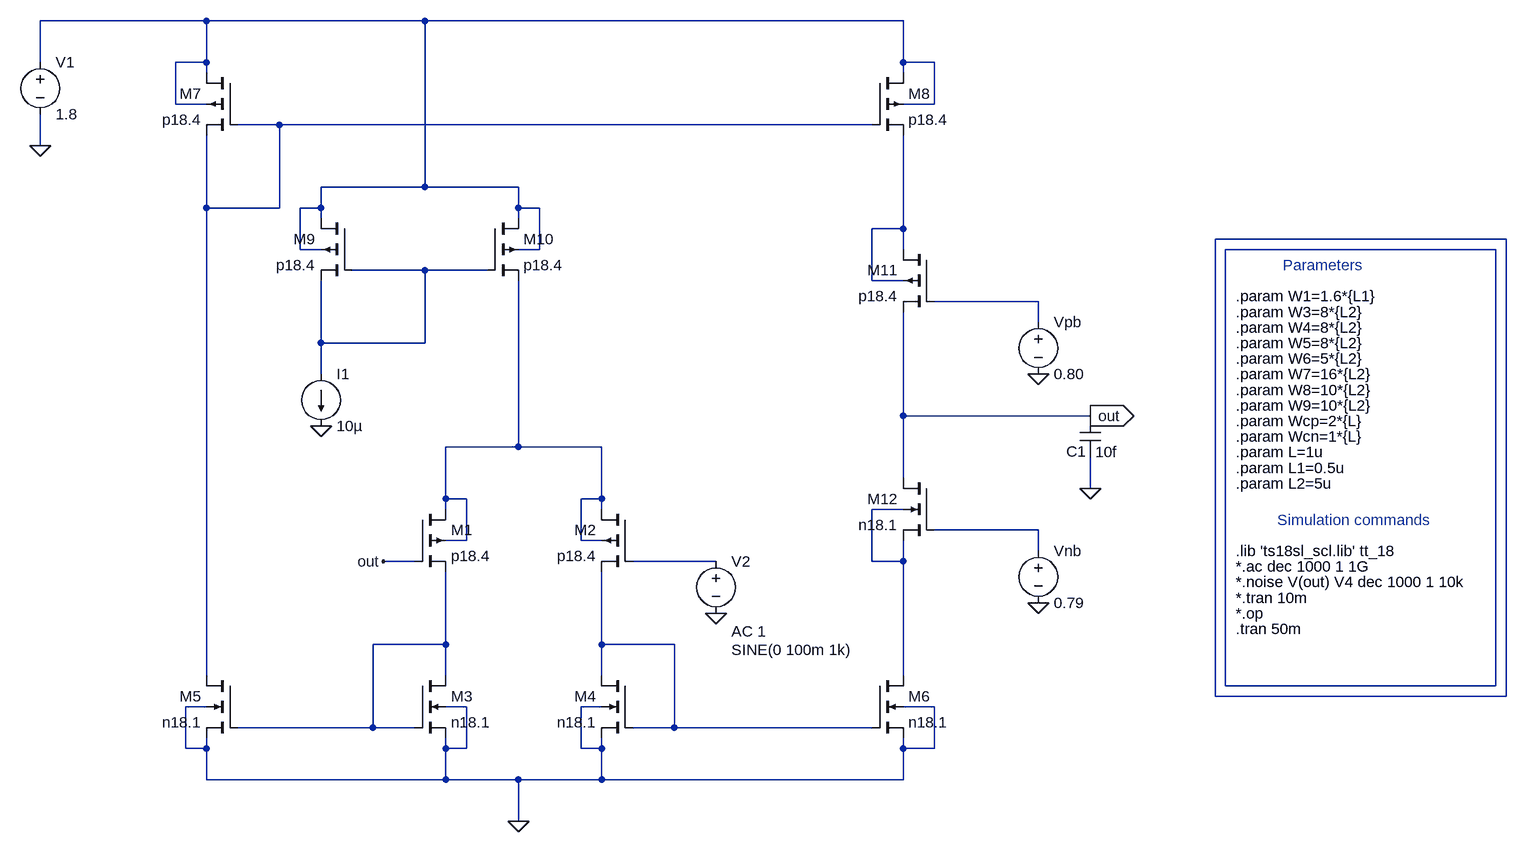
[diagram p0: schematic OTA.asc]
OTA.asc, the LTspice schematic file:
Version 4
SHEET 1 1780 1048
WIRE -224 -624 -480 -624
WIRE 112 -624 -224 -624
WIRE 848 -624 112 -624
WIRE -480 -560 -480 -624
WIRE -224 -560 -224 -624
WIRE -224 -560 -272 -560
WIRE 848 -560 848 -624
WIRE 896 -560 848 -560
WIRE -224 -544 -224 -560
WIRE 848 -544 848 -560
WIRE -272 -496 -272 -560
WIRE -224 -496 -272 -496
WIRE 896 -496 896 -560
WIRE 896 -496 848 -496
WIRE -112 -464 -176 -464
WIRE 800 -464 -112 -464
WIRE -480 -432 -480 -480
WIRE 112 -368 112 -624
WIRE 112 -368 -48 -368
WIRE 256 -368 112 -368
WIRE -224 -336 -224 -448
WIRE -112 -336 -112 -464
WIRE -112 -336 -224 -336
WIRE -48 -336 -48 -368
WIRE -48 -336 -80 -336
WIRE 256 -336 256 -368
WIRE 288 -336 256 -336
WIRE -48 -320 -48 -336
WIRE 256 -320 256 -336
WIRE 848 -304 848 -448
WIRE 848 -304 800 -304
WIRE 1776 -288 1328 -288
WIRE -80 -272 -80 -336
WIRE -48 -272 -80 -272
WIRE 288 -272 288 -336
WIRE 288 -272 256 -272
WIRE 848 -272 848 -304
WIRE 1760 -272 1344 -272
WIRE 112 -240 0 -240
WIRE 208 -240 112 -240
WIRE 800 -224 800 -304
WIRE 848 -224 800 -224
WIRE 1056 -192 896 -192
WIRE 1056 -160 1056 -192
WIRE -48 -128 -48 -224
WIRE 112 -128 112 -240
WIRE 112 -128 -48 -128
WIRE -48 -80 -48 -128
WIRE 848 -16 848 -176
WIRE 1136 -16 848 -16
WIRE 256 32 256 -224
WIRE 256 32 144 32
WIRE 384 32 256 32
WIRE 848 80 848 -16
WIRE 1136 96 1136 48
WIRE 144 112 144 32
WIRE 176 112 144 112
WIRE 384 112 384 32
WIRE 384 112 352 112
WIRE 144 128 144 112
WIRE 384 128 384 112
WIRE 848 128 800 128
WIRE 1056 160 896 160
WIRE 176 176 176 112
WIRE 176 176 144 176
WIRE 352 176 352 112
WIRE 384 176 352 176
WIRE 1056 192 1056 160
WIRE 96 208 48 208
WIRE 560 208 432 208
WIRE 800 208 800 128
WIRE 848 208 848 176
WIRE 848 208 800 208
WIRE 144 336 144 224
WIRE 144 336 32 336
WIRE 384 336 384 224
WIRE 496 336 384 336
WIRE -224 384 -224 -336
WIRE 144 384 144 336
WIRE 384 384 384 336
WIRE 848 384 848 208
WIRE 1344 400 1344 -272
WIRE 1760 400 1760 -272
WIRE 1760 400 1344 400
WIRE 1328 416 1328 -288
WIRE 1776 416 1776 -288
WIRE 1776 416 1328 416
WIRE -224 432 -256 432
WIRE 176 432 144 432
WIRE 384 432 352 432
WIRE 896 432 848 432
WIRE 32 464 32 336
WIRE 32 464 -176 464
WIRE 96 464 32 464
WIRE 496 464 496 336
WIRE 496 464 432 464
WIRE 800 464 496 464
WIRE -256 496 -256 432
WIRE -224 496 -224 480
WIRE -224 496 -256 496
WIRE 144 496 144 480
WIRE 176 496 176 432
WIRE 176 496 144 496
WIRE 352 496 352 432
WIRE 384 496 384 480
WIRE 384 496 352 496
WIRE 848 496 848 480
WIRE 896 496 896 432
WIRE 896 496 848 496
WIRE -224 544 -224 496
WIRE 144 544 144 496
WIRE 144 544 -224 544
WIRE 256 544 144 544
WIRE 384 544 384 496
WIRE 384 544 256 544
WIRE 848 544 848 496
WIRE 848 544 384 544
WIRE 256 608 256 544
FLAG -48 0 0
FLAG 256 608 0
FLAG -480 -432 0
FLAG 1136 96 0
FLAG 1056 -80 0
FLAG 1056 272 0
FLAG 1136 -16 out
IOPIN 1136 -16 Out
FLAG 48 208 out
FLAG 560 288 0
DATAFLAG 256 32 ""
DATAFLAG 256 32 ""
DATAFLAG 848 -304 ""
DATAFLAG 848 256 ""
DATAFLAG 848 256 ""
DATAFLAG -48 -128 ""
DATAFLAG -224 240 ""
DATAFLAG -112 464 ""
DATAFLAG 352 -464 ""
DATAFLAG 848 -16 ""
DATAFLAG 848 -16 ""
DATAFLAG 384 336 ""
DATAFLAG 384 336 ""
SYMBOL pmos4 96 128 R0
SYMATTR InstName M1
SYMATTR Value p18.4
SYMATTR Value2 l={L1} w={W1} ad={5*{W1}*{L1/2}} as={5*{W1}*{L1/2}} pd={5*{L1} + 2*{W1}} ps={5*{L1} + 2*{W1}}
SYMBOL nmos4 96 384 R0
SYMATTR InstName M3
SYMATTR Value n18.1
SYMATTR Value2 l={L2} w={W3} ad={5*{W3}*{L2/2}} as={5*{W3}*{L2/2}} pd={5*{L2} + 2*{W3}} ps={5*{L2} + 2*{W3}}
SYMBOL nmos4 800 384 R0
SYMATTR InstName M6
SYMATTR Value n18.1
SYMATTR Value2 l={L2} w={W6} ad={5*{W6}*{L2/2}} as={5*{W6}*{L2/2}} pd={5*{L2} + 2*{W6}} ps={5*{L2} + 2*{W6}}
SYMBOL pmos4 800 -544 R0
SYMATTR InstName M8
SYMATTR Value p18.4
SYMATTR Value2 l={L2} w={W8} ad={5*{W8}*{L2/2}} as={5*{W8}*{L2/2}} pd={5*{L2} + 2*{W8}} ps={5*{L2} + 2*{W8}}
SYMBOL pmos4 208 -320 R0
SYMATTR InstName M10
SYMATTR Value p18.4
SYMATTR Value2 l={L2} w={W9} ad={5*{W9}*{L2/2}} as={5*{W9}*{L2/2}} pd={5*{L2} + 2*{W9}} ps={5*{L2} + 2*{W9}}
SYMBOL current -48 -80 R0
WINDOW 123 0 0 Left 0
WINDOW 39 0 0 Left 0
SYMATTR InstName I1
SYMATTR Value 10µ
SYMBOL voltage -480 -576 R0
WINDOW 123 24 44 Left 2
WINDOW 39 0 0 Left 0
SYMATTR InstName V1
SYMATTR Value 1.8
SYMBOL cap 1120 -16 R0
WINDOW 0 -21 55 Left 2
SYMATTR InstName C1
SYMATTR Value 10f
SYMBOL voltage 1056 176 R0
WINDOW 123 0 0 Left 0
WINDOW 39 0 0 Left 0
SYMATTR InstName Vnb
SYMATTR Value 0.79
SYMBOL voltage 1056 -176 R0
WINDOW 123 0 0 Left 0
WINDOW 39 0 0 Left 0
SYMATTR InstName Vpb
SYMATTR Value 0.80
SYMBOL pmos4 0 -320 M0
SYMATTR InstName M9
SYMATTR Value p18.4
SYMATTR Value2 l={L2} w={W9} ad={5*{W9}*{L2/2}} as={5*{W9}*{L2/2}} pd={5*{L2} + 2*{W9}} ps={5*{L2} + 2*{W9}}
SYMBOL pmos4 -176 -544 M0
SYMATTR InstName M7
SYMATTR Value p18.4
SYMATTR Value2 l={L2} w={W7} ad={5*{W7}*{L2/2}} as={5*{W7}*{L2/2}} pd={5*{L2} + 2*{W7}} ps={5*{L2} + 2*{W7}}
SYMBOL nmos4 -176 384 M0
SYMATTR InstName M5
SYMATTR Value n18.1
SYMATTR Value2 l={L2} w={W5} ad={5*{W5}*{L2/2}} as={5*{W5}*{L2/2}} pd={5*{L2} + 2*{W5}} ps={5*{L2} + 2*{W5}}
SYMBOL nmos4 432 384 M0
SYMATTR InstName M4
SYMATTR Value n18.1
SYMATTR Value2 l={L2} w={W4} ad={5*{W4}*{L2/2}} as={5*{W4}*{L2/2}} pd={5*{L2} + 2*{W4}} ps={5*{L2} + 2*{W4}}
SYMBOL pmos4 432 128 M0
SYMATTR InstName M2
SYMATTR Value p18.4
SYMATTR Value2 l={L1} w={W1} ad={5*{W1}*{L1/2}} as={5*{W1}*{L1/2}} pd={5*{L1} + 2*{W1}} ps={5*{L1} + 2*{W1}}
SYMBOL pmos4 896 -272 M0
SYMATTR InstName M11
SYMATTR Value p18.4
SYMATTR Value2 l={L} w={Wcp} ad={5*{Wcp}*{L/2}} as={5*{Wcp}*{L/2}} pd={5*{L} + 2*{Wcp}} ps={5*{L} + 2*{Wcp}}
SYMBOL nmos4 896 80 M0
SYMATTR InstName M12
SYMATTR Value n18.1
SYMATTR Value2 l={L} w={Wcn} ad={5*{Wcn}*{L/2}} as={5*{Wcn}*{L/2}} pd={5*{L} + 2*{Wcn}} ps={5*{L} + 2*{Wcn}}
SYMBOL voltage 560 192 R0
WINDOW 3 24 152 Left 2
WINDOW 123 24 124 Left 2
WINDOW 39 0 0 Left 0
SYMATTR InstName V2
SYMATTR Value SINE(0 100m 1k)
SYMATTR Value2 AC 1
TEXT 1360 40 Left 2 !.param L=1u
TEXT 1360 -80 Left 2 !.param W7=16*{L2}
TEXT 1360 -128 Left 2 !.param W5=8*{L2}
TEXT 1360 -176 Left 2 !.param W3=8*{L2}
TEXT 1360 -56 Left 2 !.param W8=10*{L2}
TEXT 1360 -104 Left 2 !.param W6=5*{L2}
TEXT 1360 -152 Left 2 !.param W4=8*{L2}
TEXT 1360 -200 Left 2 !.param W1=1.6*{L1}
TEXT 1360 -32 Left 2 !.param W9=10*{L2}
TEXT 1360 192 Left 2 !.lib 'ts18sl_scl.lib' tt_18
TEXT 1360 216 Left 2 !*.ac dec 1000 1 1G
TEXT 1360 64 Left 2 !.param L1=0.5u
TEXT 1360 88 Left 2 !.param L2=5u
TEXT 1360 16 Left 2 !.param Wcn=1*{L}
TEXT 1360 -8 Left 2 !.param Wcp=2*{L}
TEXT 1360 240 Left 2 !*.noise V(out) V4 dec 1000 1 10k
TEXT 1360 264 Left 2 !*.tran 10m
TEXT 1360 288 Left 2 !*.op
TEXT 1432 -248 Left 2 ;Parameters
TEXT 1424 144 Left 2 ;Simulation commands
TEXT 1360 312 Left 2 !.tran 50m

The netlist it stands for:
* OTA.asc
M1 N008 out N012 N008 p18.4 l={L1} w={W1} ad={5*{W1}*{L1/2}} as={5*{W1}*{L1/2}} pd={5*{L1} + 2*{W1}} ps={5*{L1} + 2*{W1}}
M3 N012 N012 0 0 n18.1 l={L2} w={W3} ad={5*{W3}*{L2/2}} as={5*{W3}*{L2/2}} pd={5*{L2} + 2*{W3}} ps={5*{L2} + 2*{W3}}
M6 N009 N013 0 0 n18.1 l={L2} w={W6} ad={5*{W6}*{L2/2}} as={5*{W6}*{L2/2}} pd={5*{L2} + 2*{W6}} ps={5*{L2} + 2*{W6}}
M8 N001 N002 N003 N001 p18.4 l={L2} w={W8} ad={5*{W8}*{L2/2}} as={5*{W8}*{L2/2}} pd={5*{L2} + 2*{W8}} ps={5*{L2} + 2*{W8}}
M10 N001 N006 N008 N001 p18.4 l={L2} w={W9} ad={5*{W9}*{L2/2}} as={5*{W9}*{L2/2}} pd={5*{L2} + 2*{W9}} ps={5*{L2} + 2*{W9}}
I1 N006 0 10µ
V1 N001 0 1.8
C1 out 0 10f
Vnb N010 0 0.79
Vpb N007 0 0.80
M9 N001 N006 N006 N001 p18.4 l={L2} w={W9} ad={5*{W9}*{L2/2}} as={5*{W9}*{L2/2}} pd={5*{L2} + 2*{W9}} ps={5*{L2} + 2*{W9}}
M7 N001 N002 N002 N001 p18.4 l={L2} w={W7} ad={5*{W7}*{L2/2}} as={5*{W7}*{L2/2}} pd={5*{L2} + 2*{W7}} ps={5*{L2} + 2*{W7}}
M5 N002 N012 0 0 n18.1 l={L2} w={W5} ad={5*{W5}*{L2/2}} as={5*{W5}*{L2/2}} pd={5*{L2} + 2*{W5}} ps={5*{L2} + 2*{W5}}
M4 N013 N013 0 0 n18.1 l={L2} w={W4} ad={5*{W4}*{L2/2}} as={5*{W4}*{L2/2}} pd={5*{L2} + 2*{W4}} ps={5*{L2} + 2*{W4}}
M2 N008 N011 N013 N008 p18.4 l={L1} w={W1} ad={5*{W1}*{L1/2}} as={5*{W1}*{L1/2}} pd={5*{L1} + 2*{W1}} ps={5*{L1} + 2*{W1}}
M11 N003 N007 out N003 p18.4 l={L} w={Wcp} ad={5*{Wcp}*{L/2}} as={5*{Wcp}*{L/2}} pd={5*{L} + 2*{Wcp}} ps={5*{L} + 2*{Wcp}}
M12 out N010 N009 N009 n18.1 l={L} w={Wcn} ad={5*{Wcn}*{L/2}} as={5*{Wcn}*{L/2}} pd={5*{L} + 2*{Wcn}} ps={5*{L} + 2*{Wcn}}
V2 N011 0 SINE(0 100m 1k) AC 1
.model NMOS NMOS
.model PMOS PMOS
.lib standard.mos
.param L=1u
.param W7=16*{L2}
.param W5=8*{L2}
.param W3=8*{L2}
.param W8=10*{L2}
.param W6=5*{L2}
.param W4=8*{L2}
.param W1=1.6*{L1}
.param W9=10*{L2}
.lib 'ts18sl_scl.lib' tt_18
*.ac dec 1000 1 1G
.param L1=0.5u
.param L2=5u
.param Wcn=1*{L}
.param Wcp=2*{L}
*.noise V(out) V4 dec 1000 1 10k
*.tran 10m
*.op
* Parameters
* Simulation commands
.tran 50m
.backanno
.end